# Altium project flyback.PrjPcb
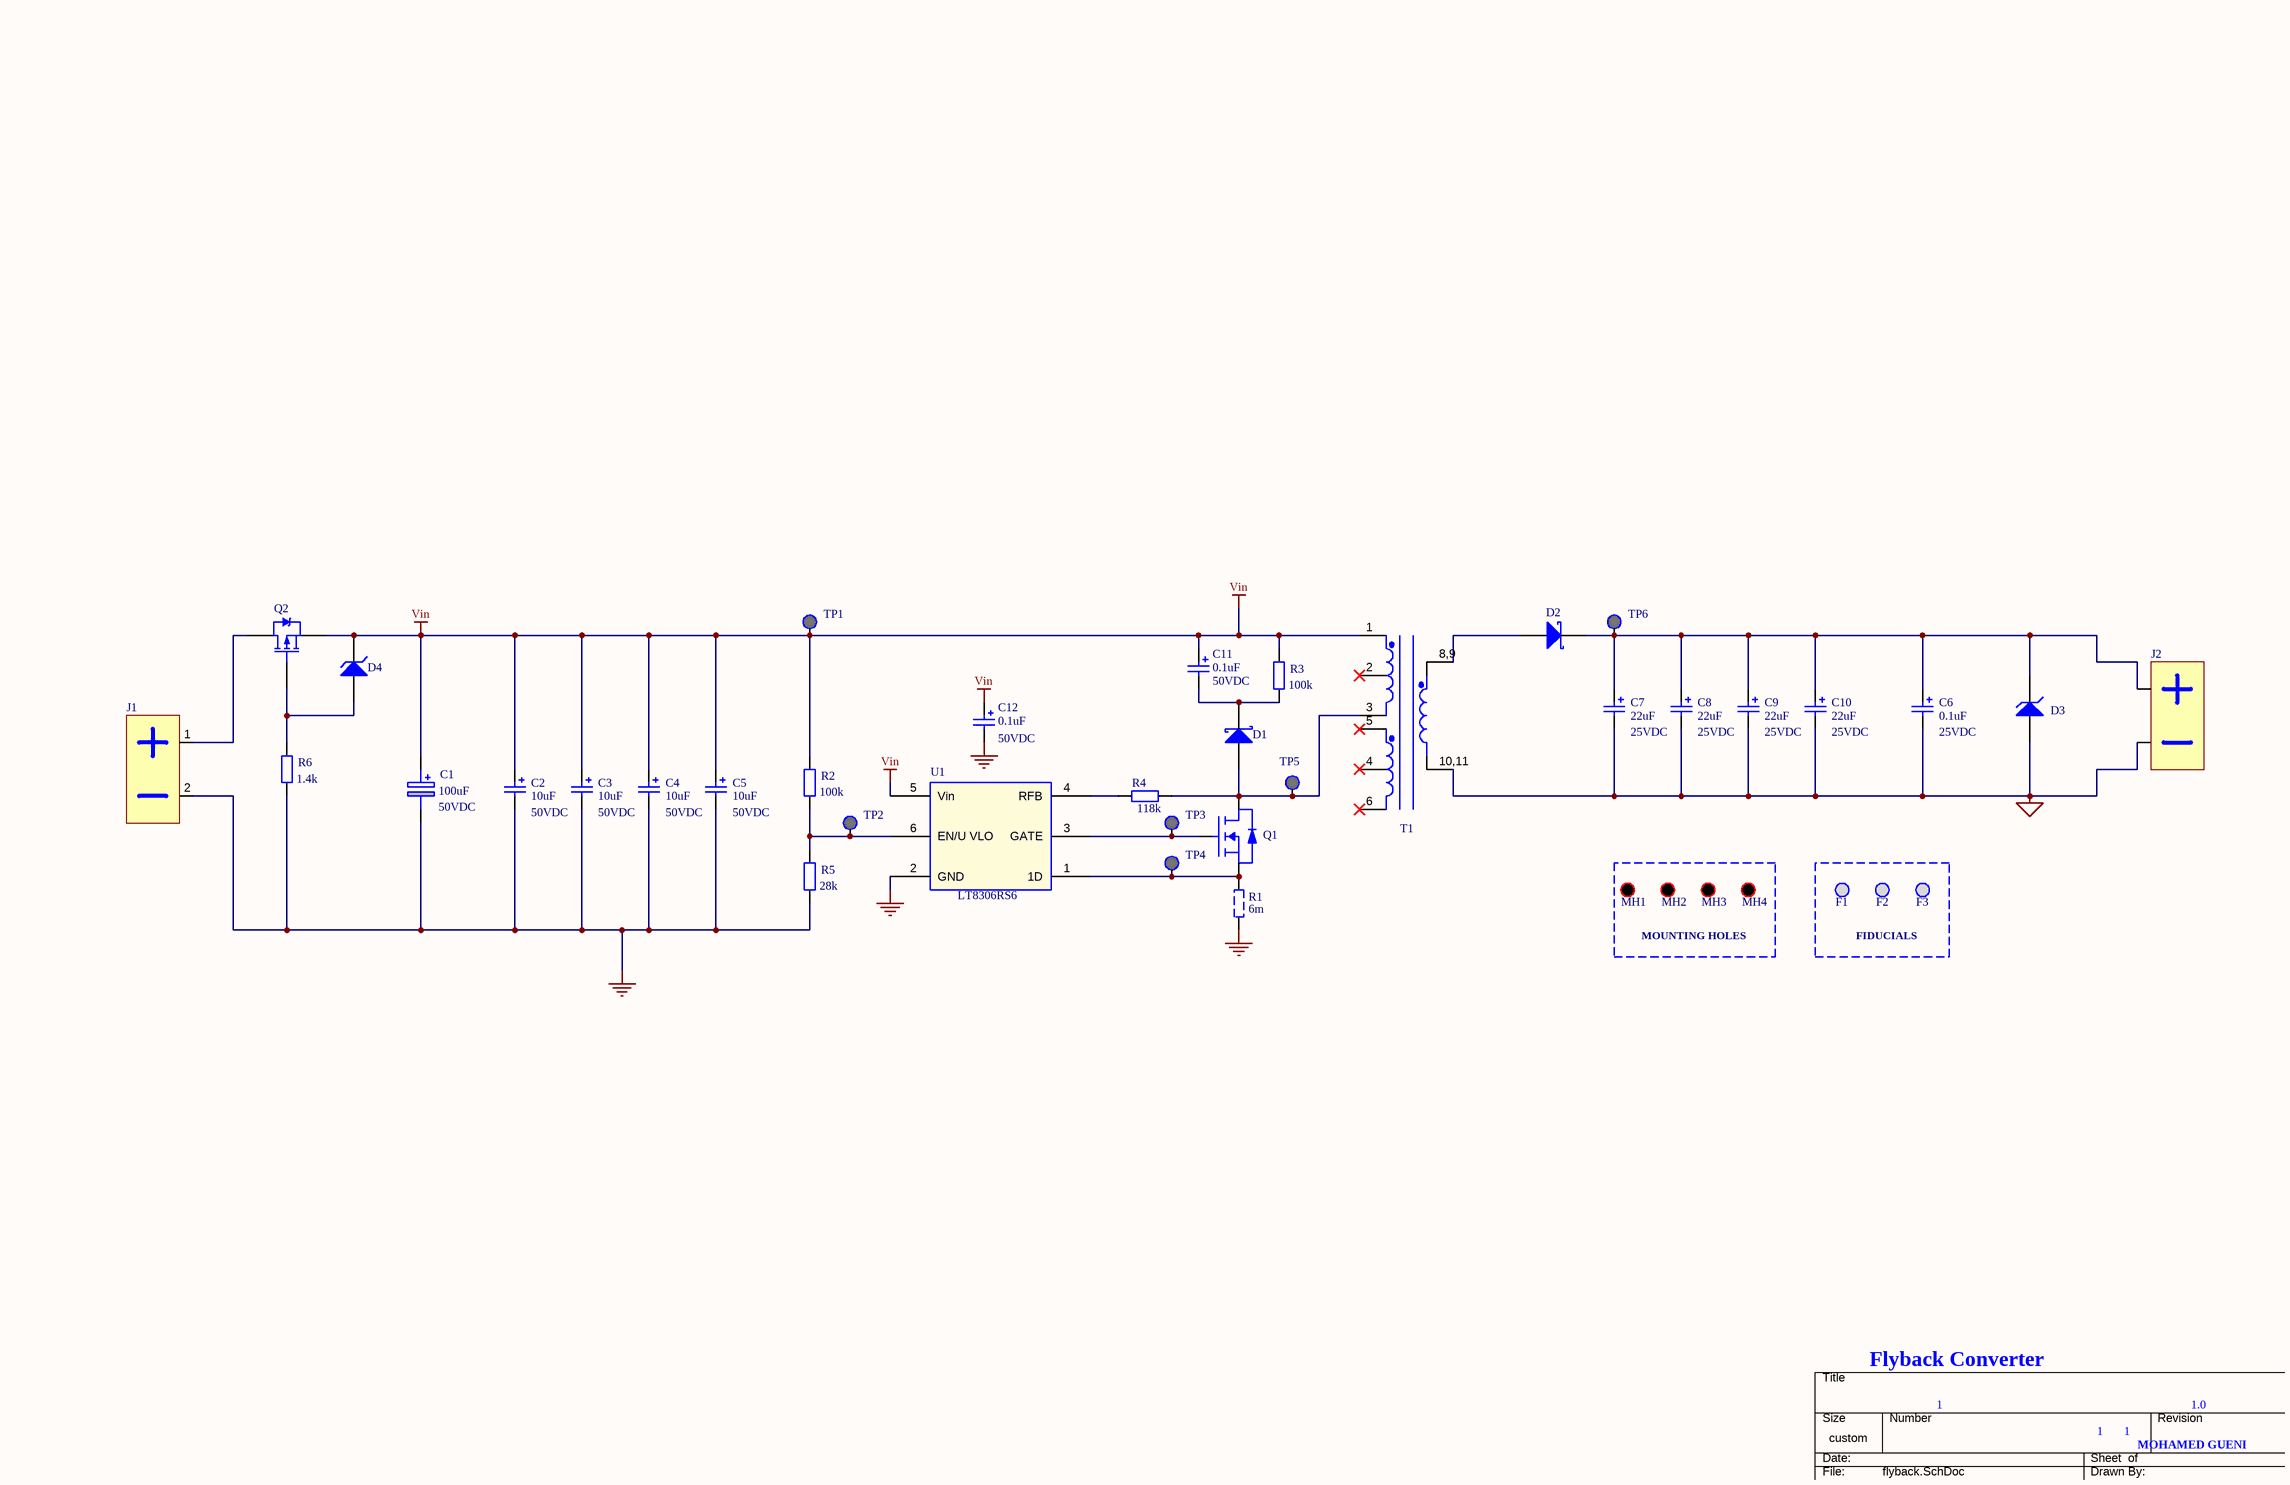
[diagram p0: flyback.SchDoc]
1 sheet, 41 parts. Net scope: global (net labels, ports and power ports of the same name join across sheets).
Board file: flyback.PcbDoc

## Sheet flyback.SchDoc: Flyback Converter
size 431 x 279 mm; SheetNumber: 1; SheetTotal: 1

### Parts
C1  50VDC  value 100uF  [ECAP-EEH-ZE1H101P]
C2  50VDC  value 10uF  [CAP-1210]
C3  50VDC  value 10uF  [CAP-1210]
C4  50VDC  value 10uF  [CAP-1210]
C5  50VDC  value 10uF  [CAP-1210]
C6  25VDC  value 0.1uF  [CAP-1210]
C7  25VDC  value 22uF  [CAP-1210]
C8  25VDC  value 22uF  [CAP-1210]
C9  25VDC  value 22uF  [CAP-1210]
C10  25VDC  value 22uF  [CAP-1210]
C11  50VDC  value 0.1uF  [CAP-1210]
C12  50VDC  value 0.1uF  [CAP-1210]
D1  Schottky Diode  [SOD-128-2]  (value not drawn)
D2  Schottky Diode  [SOD-128-2]  (value not drawn)
D3  Zener Diode  [DIOM5226X220N]  (value not drawn)
D4  Zener Diode  [SOD-123-2]  (value not drawn)
F1  Fiducial_3  [FIDUCIAL]  (value not drawn)
F2  Fiducial_3  [FIDUCIAL]  (value not drawn)
F3  Fiducial_3  [FIDUCIAL]  (value not drawn)
J1  PT Block 2P  [TBP02R1-381-02BE]  (value not drawn)
J2  PT Block 2P  [TBP02R1-381-02BE]  (value not drawn)
MH1  MH  [MH]  (value not drawn)  (no BOM)
MH2  MH  [MH]  (value not drawn)  (no BOM)
MH3  MH  [MH]  (value not drawn)  (no BOM)
MH4  MH  [MH]  (value not drawn)  (no BOM)
Q1  MOSFET N  [TDSON-8]  (value not drawn)
Q2  (no value)  [TO-252-3]
R1  value 6m  [R1206]  (hidden comment: Sense Resistors)
R2  value 100k  [R1206]  (hidden comment: Resistor)
R3  value 100k  [R1206]  (hidden comment: Resistor)
R4  value 118k  [R1206]  (hidden comment: Resistor)
R5  value 28k  [R1206]  (hidden comment: Resistor)
R6  value 1.4k  [R0603]  (hidden comment: Resistor)
T1  Transformer  [11328-T078]  (value not drawn)
TP1  TP  [TP]  (value not drawn)  (no BOM)
TP2  TP  [TP]  (value not drawn)  (no BOM)
TP3  TP  [TP]  (value not drawn)  (no BOM)
TP4  TP  [TP]  (value not drawn)  (no BOM)
TP5  TP  [TP]  (value not drawn)  (no BOM)
TP6  TP  [TP]  (value not drawn)  (no BOM)
U1  LT8306RS6#WTRMPBF  [SOT-23-6]  (value not drawn)

### Blocks framed on the sheet
MOUNTING HOLES: MH1-MH4
FIDUCIALS: F1-F3

### Nets
GND: C1.2(-) C2.2 C3.2 C4.2 C5.2 C12.2 J1.2(V-) R1.2 R5.2 R6.2 U1.2(GND)
GND2: C6.2 C7.2 C8.2 C9.2 C10.2 D3.1(A) J2.2(V-) T1.10,11
Vin: C1.1(+) C2.1 C3.1 C4.1 C5.1 C11.1 C12.1 D4.2(K) Q2.3(S) R2.1 R3.1 T1.1 TP1.1 U1.5(Vin)
NetC6_1: C6.1 C7.1 C8.1 C9.1 C10.1 D2.2(K) D3.2(K) J2.1(V+) TP6.1
NetC11_2: C11.2 D1.2(K) R3.2
NetD1_1: D1.1(A) Q1.5,6,7,8,9(D) R4.1 T1.3 TP5.1
NetD2_1: D2.1(A) T1.8,9
NetD4_1: D4.1(A) Q2.1(G) R6.1
NetJ1_1: J1.1(V+) Q2.2(D)
NetQ1_1,2,3,10: Q1.1,2,3,10(S) R1.1 TP4.1 U1.1(1D)
NetQ1_4: Q1.4(G) TP3.1 U1.3(GATE)
NetR2_2: R2.2 R5.1 TP2.1 U1.6(EN/U_VLO)
NetR4_2: R4.2 U1.4(RFB)

Not connected (* = marked no-connect by the designer): MH1 MH; MH2 MH; MH3 MH; MH4 MH; T1 2* 4* 5* 6*

### Notes on the sheet
- 1
- 1.0
- MOHAMED GUENI
- DWG. NO.
- REV.
- SHT.
- THIS DOCUMENT AND THE DATA DISCLOSED HEREIN OR HEREWITH IS THE PROPERTY OF ALTIUM LIMITED AND MAY BE FREELY DISTRIBUTED IN WHOLE. NO RIGHTS ARE RESERVED OR EXPRESS OR IMPLIED WARANTEE GIVEN.
- REVISION
- DESCRIPTION
- DATE
- APPROVED
- ENG:
- APPROVALS
- PROJECT
- DSN:
- CHK:
- REFERENCE DOCUMENTS
- PROJECT REVISION:
- TITLE
- DOCUMENT REVISION:
- DESIGN ITEM:
- BOM:
- FAB DWG:
- PCB DWG:
- ASSY DWG:
- SCALE:
- SIZE
- B
- CAGE CODE
- FILE NAME
- DWG NO.
- SHEET
- OF
- REV
- (in symbol LT8306RS6#WTRMPBF) LT8306RS6

### Library data of the parts
C1 = CAP_Electrolytic
C2-C12 = CAP_Ceramic
MH1-MH4 = MH: Mounting Hole
Q2 = MOSFET P
R1 = Sense Resistors: Current Sense Resistors - SMD 0.006 ohm 1% 1.5W2
TP1-TP6 = TP: Test Point
D1 D2 = Schottky Diode: ComponentLink1Description: Manufacturer Link; ComponentLink1URL: http://www.infineon.com/; ComponentLink2Description: Datasheet; ComponentLink2URL: http://www.infineon.com/upload/Document/cmc_upload/documents/009/382/bas40_bas140series_1.pdf